# Altium project fcu.PrjPcb
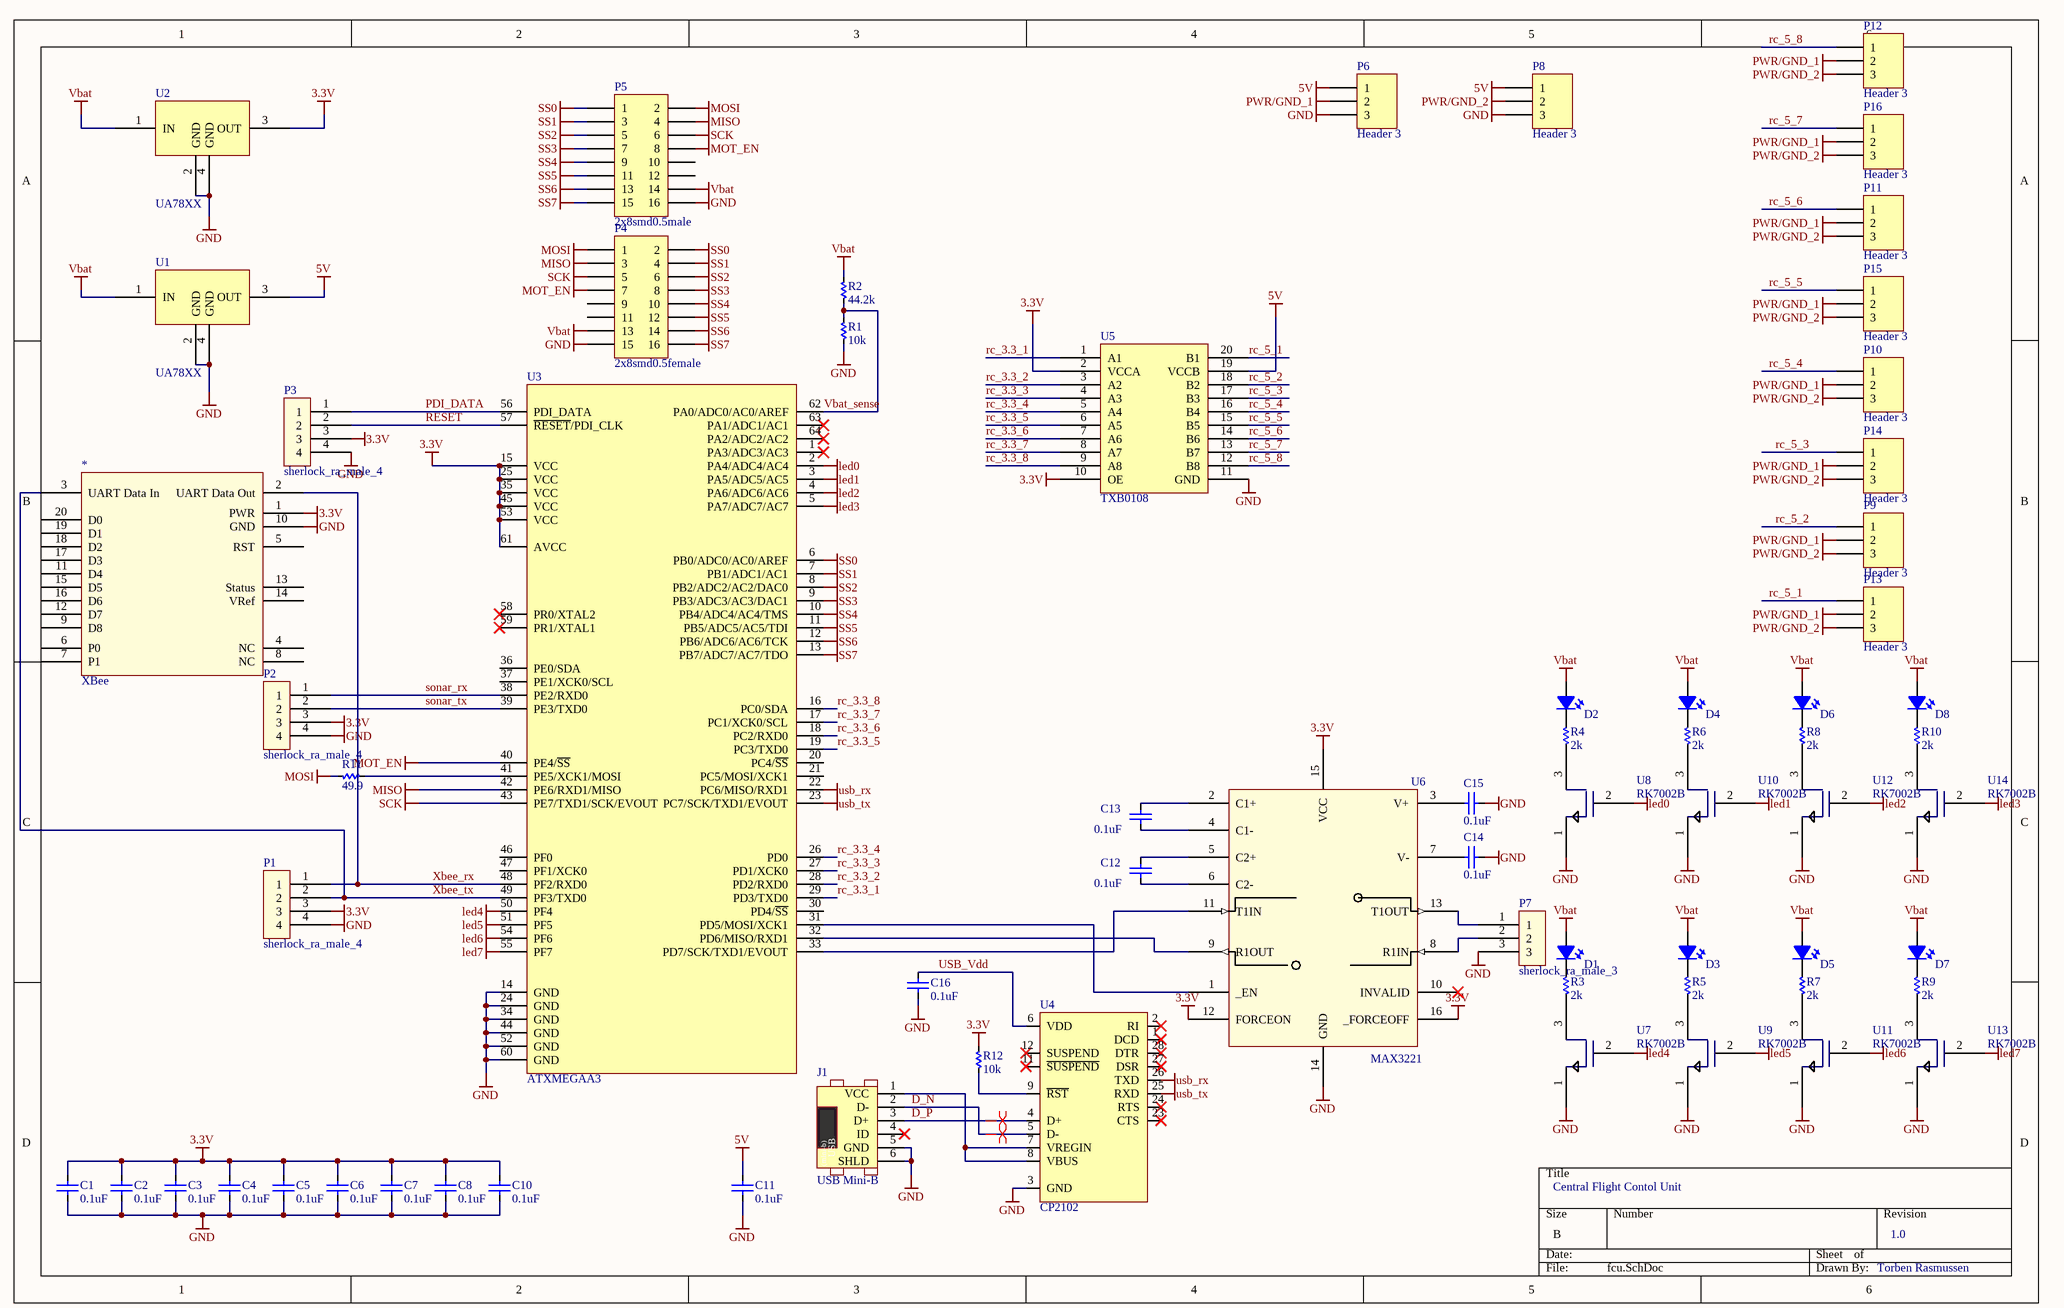
[diagram p0: fcu.SchDoc]
1 sheet, 67 parts. Net scope: global (net labels, ports and power ports of the same name join across sheets).
Board file: fcu.PcbDoc

## Sheet fcu.SchDoc
size B

### Parts
*  XBee  [XBee]
C1  value 0.1uF  [0603 (1608) RECT]  (hidden comment: Capacitor)
C2  value 0.1uF  [0603 (1608) RECT]  (hidden comment: Capacitor)
C3  value 0.1uF  [0603 (1608) RECT]  (hidden comment: Capacitor)
C4  value 0.1uF  [0603 (1608) RECT]  (hidden comment: Capacitor)
C5  value 0.1uF  [0603 (1608) RECT]  (hidden comment: Capacitor)
C6  value 0.1uF  [0603 (1608) RECT]  (hidden comment: Capacitor)
C7  value 0.1uF  [0603 (1608) RECT]  (hidden comment: Capacitor)
C8  value 0.1uF  [0603 (1608) RECT]  (hidden comment: Capacitor)
C10  value 0.1uF  [0603 (1608) RECT]  (hidden comment: Capacitor)
C11  value 0.1uF  [0603 (1608) RECT]  (hidden comment: Capacitor)
C12  value 0.1uF  [0603 (1608) RECT]  (hidden comment: Capacitor)
C13  value 0.1uF  [0603 (1608) RECT]  (hidden comment: Capacitor)
C14  value 0.1uF  [0603 (1608) RECT]  (hidden comment: Capacitor)
C15  value 0.1uF  [0603 (1608) RECT]  (hidden comment: Capacitor)
C16  value 0.1uF  [0603 (1608) RECT]  (hidden comment: Capacitor)
D1  LED  [LED 0603 (1608)]  (value not drawn)
D2  LED  [LED 0603 (1608)]  (value not drawn)
D3  LED  [LED 0603 (1608)]  (value not drawn)
D4  LED  [LED 0603 (1608)]  (value not drawn)
D5  LED  [LED 0603 (1608)]  (value not drawn)
D6  LED  [LED 0603 (1608)]  (value not drawn)
D7  LED  [LED 0603 (1608)]  (value not drawn)
D8  LED  [LED 0603 (1608)]  (value not drawn)
J1  USB Mini-B  [USB MINI-B (PCB TAB)]
P1  sherlock_ra_male_4  [sherlock_ra_male_4]
P2  sherlock_ra_male_4  [sherlock_ra_male_4]
P3  sherlock_ra_male_4  [sherlock_ra_male_4]
P4  2x8smd0.5female  [S9007E-08-ND]
P5  2x8smd0.5male  [S9007E-08-ND-noholes]
P6  Header 3  [HDR1X3]
P7  sherlock_ra_male_3  [sherlock_ra_male_3]
P8  Header 3  [HDR1X3]
P9  Header 3  [HDR1X3]
P10  Header 3  [HDR1X3]
P11  Header 3  [HDR1X3]
P12  Header 3  [HDR1X3]
P13  Header 3  [HDR1X3]
P14  Header 3  [HDR1X3]
P15  Header 3  [HDR1X3]
P16  Header 3  [HDR1X3]
R1  value 10k  [0603 (1608) BRACKET]  (hidden comment: Resistor)
R2  value 44.2k  [0603 (1608) BRACKET]  (hidden comment: Resistor)
R3  value 2k  [0603 (1608) BRACKET]  (hidden comment: Resistor)
R4  value 2k  [0603 (1608) BRACKET]  (hidden comment: Resistor)
R5  value 2k  [0603 (1608) BRACKET]  (hidden comment: Resistor)
R6  value 2k  [0603 (1608) BRACKET]  (hidden comment: Resistor)
R7  value 2k  [0603 (1608) BRACKET]  (hidden comment: Resistor)
R8  value 2k  [0603 (1608) BRACKET]  (hidden comment: Resistor)
R9  value 2k  [0603 (1608) BRACKET]  (hidden comment: Resistor)
R10  value 2k  [0603 (1608) BRACKET]  (hidden comment: Resistor)
R11  value 49.9  [0603 (1608) BRACKET]  (hidden comment: Resistor)
R12  value 10k  [0603 (1608) BRACKET]  (hidden comment: Resistor)
U1  UA78XX  [SOT-223]
U2  UA78XX  [SOT-223]
U3  ATXMEGAA3  [QFN-64]
U4  CP2102  [QFN28 5x5 SILABS]
U5  TXB0108  [TSSOP-20]
U6  MAX3221  [TSSOP-16]
U7  RK7002B  [SOT-23-RK7002B]
U8  RK7002B  [SOT-23-RK7002B]
U9  RK7002B  [SOT-23-RK7002B]
U10  RK7002B  [SOT-23-RK7002B]
U11  RK7002B  [SOT-23-RK7002B]
U12  RK7002B  [SOT-23-RK7002B]
U13  RK7002B  [SOT-23-RK7002B]
U14  RK7002B  [SOT-23-RK7002B]

### Nets
3.3V: *.1(PWR) C1.1 C2.1 C3.1 C4.1 C5.1 C6.1 C7.1 C8.1 C10.1 P1.3 P2.3 P3.3 R12.1 U2.3(OUT) U3.15(VCC) U3.25(VCC) U3.35(VCC) U3.45(VCC) U3.53(VCC) U3.61(AVCC) U5.2(VCCA) U5.10(OE) U6.12(FORCEON) U6.15(VCC) U6.16(_FORCEOFF)
5V: C11.1 P6.1 P8.1 U1.3(OUT) U5.19(VCCB)
GND: *.10(GND) C1.2 C2.2 C3.2 C4.2 C5.2 C6.2 C7.2 C8.2 C10.2 C11.2 C14.2 C15.2 C16.2 J1.5(GND) J1.6(SHLD) P1.4 P2.4 P3.4 P4.15 P5.16 P6.3 P7.3 P8.3 R1.1 U1.2(GND) U1.4(GND) U2.2(GND) U2.4(GND) U3.14(GND) U3.24(GND) U3.34(GND) U3.44(GND) U3.52(GND) U3.60(GND) U4.3(GND) U5.11(GND) U6.14(GND) U7.1(S) U8.1(S) U9.1(S) U10.1(S) U11.1(S) U12.1(S) U13.1(S) U14.1(S)
led0: U3.2(PA4/ADC4/AC4) U8.2(G)
led1: U3.3(PA5/ADC5/AC5) U10.2(G)
led2: U3.4(PA6/ADC6/AC6) U12.2(G)
led3: U3.5(PA7/ADC7/AC7) U14.2(G)
led4: U3.50(PF4) U7.2(G)
led5: U3.51(PF5) U9.2(G)
led6: U3.54(PF6) U11.2(G)
led7: U3.55(PF7) U13.2(G)
MISO: P4.3 P5.4 U3.42(PE6/RXD1/MISO)
MOSI: P4.1 P5.2 R11.2
MOT_EN: P4.7 P5.8 U3.40(PE4/~{SS})
PWR/GND_1: P6.2 P9.2 P10.2 P11.2 P12.2 P13.2 P14.2 P15.2 P16.2
PWR/GND_2: P8.2 P9.3 P10.3 P11.3 P12.3 P13.3 P14.3 P15.3 P16.3
SCK: P4.5 P5.6 U3.43(PE7/TXD1/SCK/EVOUT)
SS0: P4.2 P5.1 U3.6(PB0/ADC0/AC0/AREF)
SS1: P4.4 P5.3 U3.7(PB1/ADC1/AC1)
SS2: P4.6 P5.5 U3.8(PB2/ADC2/AC2/DAC0)
SS3: P4.8 P5.7 U3.9(PB3/ADC3/AC3/DAC1)
SS4: P4.10 P5.9 U3.10(PB4/ADC4/AC4/TMS)
SS5: P4.12 P5.11 U3.11(PB5/ADC5/AC5/TDI)
SS6: P4.14 P5.13 U3.12(PB6/ADC6/AC6/TCK)
SS7: P4.16 P5.15 U3.13(PB7/ADC7/AC7/TDO)
usb_rx: U3.22(PC6/MISO/RXD1) U4.26(TXD)
usb_tx: U3.23(PC7/SCK/TXD1/EVOUT) U4.25(RXD)
Vbat: D1.1 D2.1 D3.1 D4.1 D5.1 D6.1 D7.1 D8.1 P4.13 P5.14 R2.2 U1.1(IN) U2.1(IN)
D_N: J1.2(D-) U4.5(D-)
D_P: J1.3(D+) U4.4(D+)
PDI_DATA: P3.1 U3.56(PDI_DATA)
rc_3.3_1: U3.29(PD3/TXD0) U5.1(A1)
rc_3.3_2: U3.28(PD2/RXD0) U5.3(A2)
rc_3.3_3: U3.27(PD1/XCK0) U5.4(A3)
rc_3.3_4: U3.26(PD0) U5.5(A4)
rc_3.3_5: U3.19(PC3/TXD0) U5.6(A5)
rc_3.3_6: U3.18(PC2/RXD0) U5.7(A6)
rc_3.3_7: U3.17(PC1/XCK0/SCL) U5.8(A7)
rc_3.3_8: U3.16(PC0/SDA) U5.9(A8)
rc_5_1: P13.1 U5.20(B1)
rc_5_2: P9.1 U5.18(B2)
rc_5_3: P14.1 U5.17(B3)
rc_5_4: P10.1 U5.16(B4)
rc_5_5: P15.1 U5.15(B5)
rc_5_6: P11.1 U5.14(B6)
rc_5_7: P16.1 U5.13(B7)
rc_5_8: P12.1 U5.12(B8)
RESET: P3.2 U3.57(~{RESET}/PDI_CLK)
sonar_rx: P2.1 U3.38(PE2/RXD0)
sonar_tx: P2.2 U3.39(PE3/TXD0)
USB_Vdd: C16.1 U4.6(VDD)
Vbat_sense: R1.2 R2.1 U3.62(PA0/ADC0/AC0/AREF)
Xbee_rx: *.2(UART_Data_Out) P1.1 U3.48(PF2/RXD0)
Xbee_tx: *.3(UART_Data_In) P1.2 U3.49(PF3/TXD0)
NetC12_1: C12.1 U6.6(C2-)
NetC12_2: C12.2 U6.5(C2+)
NetC13_1: C13.1 U6.2(C1+)
NetC13_2: C13.2 U6.4(C1-)
NetC14_1: C14.1 U6.7(V-)
NetC15_1: C15.1 U6.3(V+)
NetD1_2: D1.2 R3.1
NetD2_2: D2.2 R4.1
NetD3_2: D3.2 R5.1
NetD4_2: D4.2 R6.1
NetD5_2: D5.2 R7.1
NetD6_2: D6.2 R8.1
NetD7_2: D7.2 R9.1
NetD8_2: D8.2 R10.1
NetJ1_1: J1.1(VCC) U4.7(VREGIN) U4.8(VBUS)
NetP7_1: P7.1 U6.13(T1OUT)
NetP7_2: P7.2 U6.8(R1IN)
NetR3_2: R3.2 U7.3(D)
NetR4_2: R4.2 U8.3(D)
NetR5_2: R5.2 U9.3(D)
NetR6_2: R6.2 U10.3(D)
NetR7_2: R7.2 U11.3(D)
NetR8_2: R8.2 U12.3(D)
NetR9_2: R9.2 U13.3(D)
NetR10_2: R10.2 U14.3(D)
NetR11_1: R11.1 U3.41(PE5/XCK1/MOSI)
NetR12_2: R12.2 U4.9(~{RST})
NetU3_31: U3.31(PD5/MOSI/XCK1) U6.1(_EN)
NetU3_32: U3.32(PD6/MISO/RXD1) U6.9(R1OUT)
NetU3_33: U3.33(PD7/SCK/TXD1/EVOUT) U6.11(T1IN)

Not connected (* = marked no-connect by the designer): * 4(NC) 5(RST) 6(P0) 7(P1) 8(NC) 9(D8) 11(D4) 12(D7) 13(Status) 14(VRef) 15(D5) 16(D6) 17(D3) 18(D2) 19(D1) 20(D0); J1 4(ID)*; P4 9 11; P5 10 12; U3 1(PA3/ADC3/AC3)* 20(PC4/~{SS}) 21(PC5/MOSI/XCK1) 30(PD4/~{SS}) 36(PE0/SDA) 37(PE1/XCK0/SCL) 46(PF0) 47(PF1/XCK0) 58(PR0/XTAL2)* 59(PR1/XTAL1)* 63(PA1/ADC1/AC1)* 64(PA2/ADC2/AC2)*; U4 1(DCD)* 2(RI)* 11(~{SUSPEND})* 12(SUSPEND)* 23(CTS)* 24(RTS)* 27(DSR)* 28(DTR)*; U6 10(INVALID)*

### Layout directives
differential pair: D_N, D_P

### Notes on the sheet
- Central Flight Contol Unit
- 1.0
- Torben Rasmussen
- (in symbol USB Mini-B) USB; (mini-b)

### Library data of the parts
C1-C8 C10-C16 = Capacitor: Manufacturer: Murata; Part No.: GRM188xxxxxxxxx; Vendor: Mouser; Price Est.: $0.10
D1-D8 = LED: Part No.: LTST-C170XXX; Manufacturer: Lite-On; Vendor: Mouser; Price Est.: $0.36
J1 = USB Mini-B: pin to pad: 1>VBUS 2>D- 3>D+ 4>ID 5>GND 6>SHLD; Part No.: 54819-0572; Manufacturer: Molex; Vendor: Mouser; Notes: Mini-AB Recpeptical Variant: 56579-0576; Price Est.: $1.56
P4 = 2x8smd0.5female: Vendor: Digikey; Part No.: S9007E-08-ND; Price Est.: 1.43
P5 = 2x8smd0.5male: Part No.: S9013E-08-ND; Vendor: Digikey; Price Est.: 1.43
P6 P8-P16 = Header 3: Header, 3-Pin; LatestRevisionDate: 17-Jul-2002; LatestRevisionNote: Re-released for DXP Platform.; Publisher: Altium Limited
R1-R12 = Resistor: Part No.: CRCW06031K00xxxxxxxxxx; Part No. Ref: CRCW[PACKAGE][VALUE]; Manufacturer: Vishay / Dale; Vendor: Mouser; Price Est.: $0.06
U3 = ATXMEGAA3: Manufacturer: Atmel; Part No.: ATXMEGA128A3; Vendor: Mouser; Price Est.: $8.06
U4 = CP2102: Manufacturer: Silicon Labs; Vendor: Mouser; Part No.: CP2102; Price Est.: $3.66
U5 = TXB0108: Manufacturer: Texas Instruments; Vendor: Mouser; Price Est.: 2.76; Part No.: TXB0108